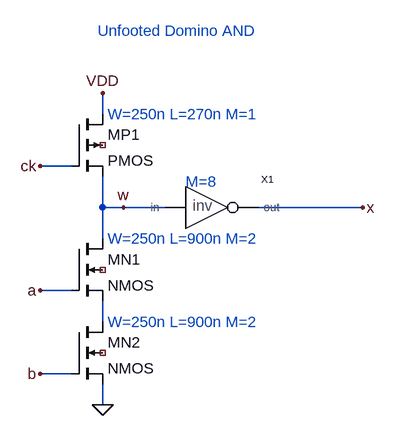
[diagram p0: schematic UD_AND.asc]
UD_AND.asc, the LTspice schematic file:
Version 4
SHEET 1 1140 680
WIRE 208 -128 208 -160
WIRE 160 -48 112 -48
WIRE 208 16 208 -32
WIRE 240 16 208 16
WIRE 304 16 240 16
WIRE 608 16 448 16
WIRE 208 64 208 16
WIRE 160 144 112 144
WIRE 208 192 208 160
WIRE 160 272 112 272
WIRE 208 320 208 288
FLAG 112 -48 ck
FLAG 112 144 a
FLAG 112 272 b
FLAG 208 -160 VDD
FLAG 208 320 0
FLAG 240 16 w
FLAG 608 16 x
SYMBOL nmos4 160 192 R0
SYMATTR InstName MN2
SYMBOL nmos4 160 64 R0
SYMATTR InstName MN1
SYMBOL pmos4 160 -128 R0
SYMATTR InstName MP1
SYMBOL inv 400 16 R0
SYMATTR InstName X1
TEXT 200 -256 Left 2 ;Unfooted Domino AND
TEXT 216 -128 Left 2 ;W=250n L=270n M=1
TEXT 216 64 Left 2 ;W=250n L=900n M=2
TEXT 216 192 Left 2 ;W=250n L=900n M=2
TEXT 336 -24 Left 2 ;M=8

The netlist it stands for:
* UD_AND.asc
MN2 N001 b 0 NC_01 NMOS
MN1 w a N001 NC_02 NMOS
MP1 VDD ck w NC_03 PMOS
XX1 w x inv  ; pins in out
.model NMOS NMOS
.model PMOS PMOS
.lib standard.mos
* Unfooted Domino AND
* W=250n L=270n M=1
* W=250n L=900n M=2
* W=250n L=900n M=2
* M=8
.backanno
.end